# Altium schematic sheet 03 TOPOLOGY.SchDoc: TOPOLOGY
size 420 x 297 mm; SheetNumber: 3; SheetTotal: 4
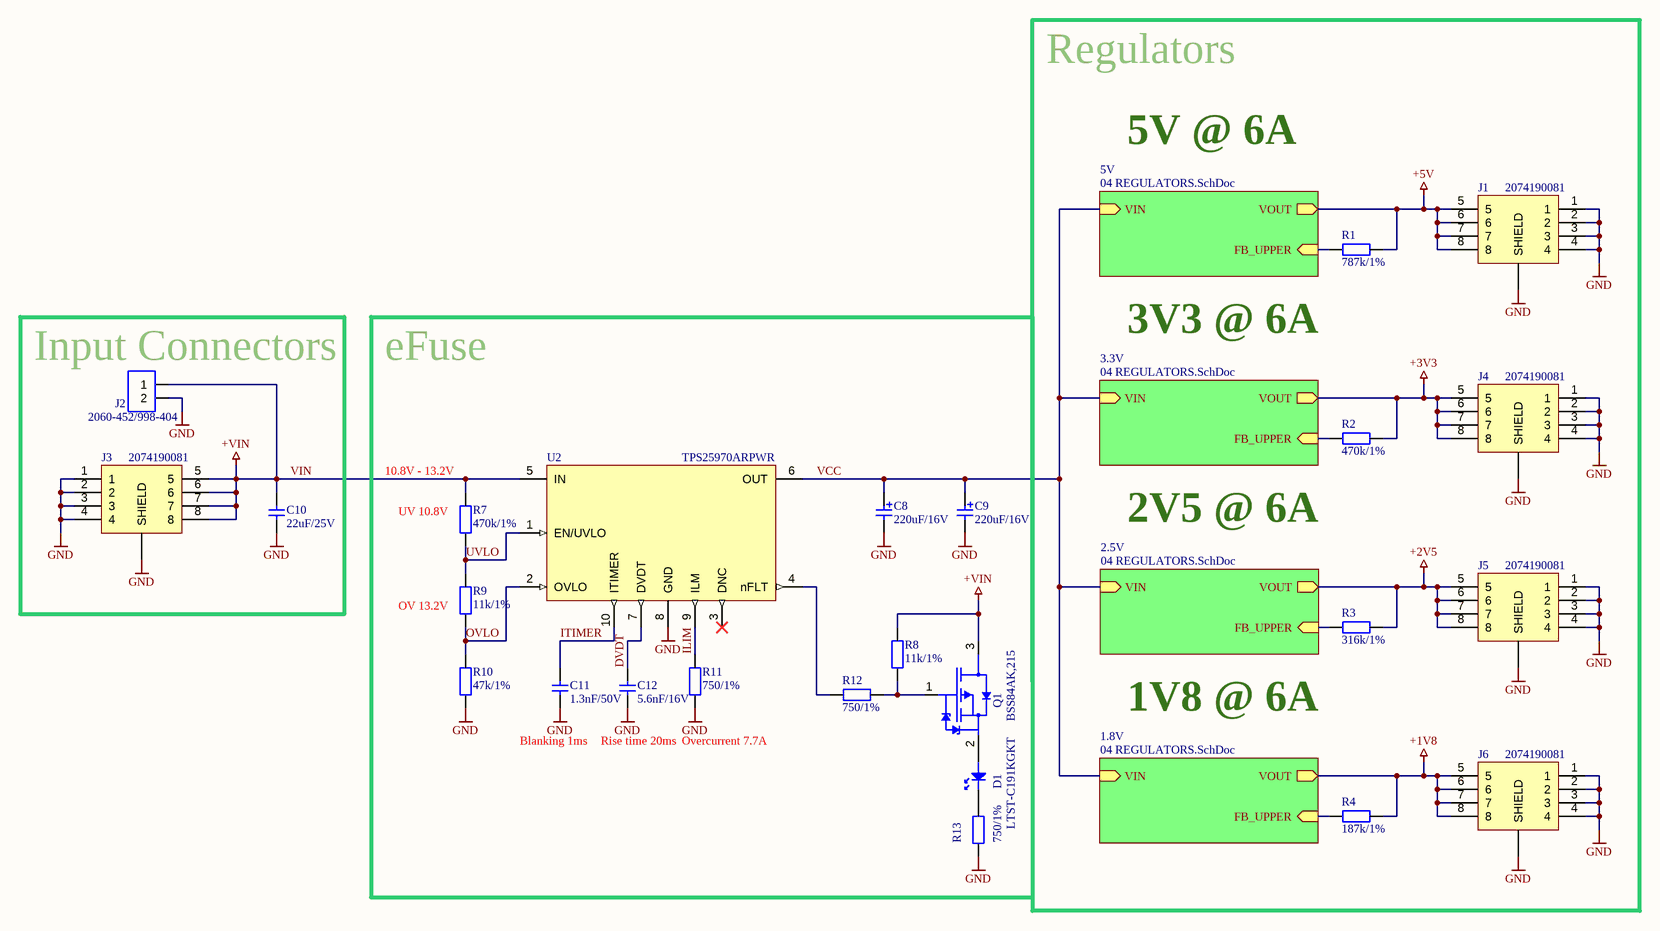
[diagram p0: 03 TOPOLOGY.SchDoc]

## Parts
C8  220uF/16V  [TANTAL/2917]
C9  220uF/16V  [TANTAL/2917]
C10  22uF/25V  [CAPC2012X14M]
C11  1.3nF/50V  [CAPC1005X07M]
C12  5.6nF/16V  [CAPC1005X07M]
D1  LTST-C191KGKT  [LED-0603]
J1  2074190081  [2074190081]
J2  2060-452/998-404  [2060-452/998-404]
J3  2074190081  [2074190081]
J4  2074190081  [2074190081]
J5  2074190081  [2074190081]
J6  2074190081  [2074190081]
Q1  BSS84AK,215  [SOT95P230X110-3M]
R1  787k/1%  [RESC1005X04M]
R2  470k/1%  [RESC1005X04M]
R3  316k/1%  [RESC1005X04M]
R4  187k/1%  [RESC1005X04M]
R7  470k/1%  [RESC1005X04M]
R8  11k/1%  [RESC1005X04M]
R9  11k/1%  [RESC1005X04M]
R10  47k/1%  [RESC1005X04M]
R11  750/1%  [RESC1005X04M]
R12  750/1%  [RESC1005X04M]
R13  750/1%  [RESC1005X04M]
U2  TPS25970ARPWR  [QFN45P200X200X100-16L]

## Blocks framed on the sheet
Input Connectors: C10 J2 J3

## Sub-sheets
1.8V = 04 REGULATORS.SchDoc: VIN (in), VOUT (out), FB_UPPER (in)
2.5V = 04 REGULATORS.SchDoc: VIN (in), VOUT (out), FB_UPPER (in)
3.3V = 04 REGULATORS.SchDoc: VIN (in), VOUT (out), FB_UPPER (in)
5V = 04 REGULATORS.SchDoc: VIN (in), VOUT (out), FB_UPPER (in)

## Nets
+1V8: J6.5 J6.6 J6.7 J6.8 R4.2 ; sheet 1.8V/VOUT
+2V5: J5.5 J5.6 J5.7 J5.8 R3.2 ; sheet 2.5V/VOUT
+3V3: J4.5 J4.6 J4.7 J4.8 R2.2 ; sheet 3.3V/VOUT
+5V: J1.5 J1.6 J1.7 J1.8 R1.2 ; sheet 5V/VOUT
GND: C8.2 C9.2 C10.1 C11.1 C12.1 J1.1 J1.2 J1.3 J1.4 J1.SHLD(SHIELD) J2.2 J3.1 J3.2 J3.3 J3.4 J3.SHLD(SHIELD) J4.1 J4.2 J4.3 J4.4 J4.SHLD(SHIELD) J5.1 J5.2 J5.3 J5.4 J5.SHLD(SHIELD) J6.1 J6.2 J6.3 J6.4 J6.SHLD(SHIELD) R10.1 R11.1 R13.1 U2.8(GND)
VIN: C10.2 J2.1 J3.5 J3.6 J3.7 J3.8 Q1.3(D) R7.2 R8.2 U2.5(IN)  [also labelled +VIN]
DVDT: C12.2 U2.7(DVDT)
ILIM: R11.2 U2.9(ILM)
ITIMER: C11.2 U2.10(ITIMER)
OVLO: R9.1 R10.2 U2.2(OVLO)
UVLO: R7.1 R9.2 U2.1(EN/UVLO)
VCC: C8.1 C9.1 U2.6(OUT) ; sheet 5V/VIN, sheet 3.3V/VIN, sheet 2.5V/VIN, sheet 1.8V/VIN
NetD1_1: D1.1 R13.2
NetD1_2: D1.2 Q1.2(S)
NetQ1_1: Q1.1(G) R8.1 R12.2
NetR1_1: R1.1 ; sheet 5V/FB_UPPER
NetR2_1: R2.1 ; sheet 3.3V/FB_UPPER
NetR3_1: R3.1 ; sheet 2.5V/FB_UPPER
NetR4_1: R4.1 ; sheet 1.8V/FB_UPPER
NetR12_1: R12.1 U2.4(nFLT)

Not connected (* = marked no-connect by the designer): U2 3(DNC)*

## Notes on the sheet
- Regulators
- 5V @ 6A
- 3V3 @ 6A
- eFuse
- (near R7) 10.8V - 13.2V
- (near R7) UV 10.8V
- 2V5 @ 6A
- (near R9) OV 13.2V
- Blanking 1ms
- Rise time 20ms
- (near R11) Overcurrent 7.7A
- 1V8 @ 6A
- Title
- Project
- Size
- Date
- Revision
- A3
- Designed By

## Library data of the parts
C8 C9 = T491D227K016AT: 220 µF Molded Tantalum Capacitors 16 V 2917 (7343 Metric) 500mOhm; ComponentLink1Description: Datasheet; ComponentLink1URL: https://connect.kemet.com:7667/gateway/IntelliData-ComponentDocumentation/1.0/download/datasheet/T491D227K016AT; MPN: T491D227K016AT
C10 = GRT21BR61E226ME13L: 22 µF ±20% 25V Ceramic Capacitor X5R 0805 (2012 Metric); ComponentLink1Description: Datasheet; ComponentLink1URL: https://search.murata.co.jp/Ceramy/image/img/A01X/G101/ENG/GRT21BR61E226ME13-01.pdf; MPN: GRT21BR61E226ME13L
C11 = C0402C132J5GAC7867: 1300 pF ±5% 50V Ceramic Capacitor C0G, NP0 0402 (1005 Metric); ComponentLink1Description: Datasheet; ComponentLink1URL: https://connect.kemet.com:7667/gateway/IntelliData-ComponentDocumentation/1.0/download/datasheet/C0402C132J5GAC7867; MPN: C0402C132J5GAC7867
C12 = CC0402KRX7R7BB562: 5600 pF ±10% 16V Ceramic Capacitor X7R 0402 (1005 Metric); ComponentLink1Description: Datasheet; ComponentLink1URL: https://www.yageo.com/upload/media/product/productsearch/datasheet/mlcc/UPY-GPHC_X7R_6.3V-to-250V_23.pdf; MPN: CC0402KRX7R7BB562
D1 = LTST-C191KGKT: Green 571nm LED Indication - Discrete 2V 0603 (1608 Metric); ComponentLink1Description: Datasheet; ComponentLink1URL: https://optoelectronics.liteon.com/upload/download/DS22-2000-228/LTST-C191KGKT.PDF; MPN: LTST-C191KGKT
J1 J3-J6 = 2074190081: 8 (4 + 4 Power) Position Connector Receptacle, Center Strip Contacts Surface Mount Gold; ComponentLink1Description: Datasheet; ComponentLink1URL: https://www.molex.com/pdm_docs/sd/2074190081_sd.pdf; MPN: 2074190081
J2 = 2060-452/998-404: 2 Position Wire to Board Terminal Block Horizontal with Board 0.157" (4.00mm) Surface Mount; ComponentLink1Description: Datasheet; ComponentLink1URL: https://www.wago.com/global/products/datasheets/Datasheet.pdf?product=2060-452/998-404&lang=en; MPN: 2060-452/998-404
Q1 = BSS84AK,215: P-Channel 50 V 180mA (Ta) 350mW (Ta), 1.14W (Tc) Surface Mount TO-236AB; ComponentLink1Description: Datasheet; ComponentLink1URL: https://assets.nexperia.com/documents/data-sheet/BSS84AK.pdf; MPN: BSS84AK,215
R1 = CRCW0402787KFKED: 787 kOhms ±1% 0.063W, 1/16W Chip Resistor 0402 (1005 Metric) Automotive AEC-Q200 Thick Film; ComponentLink1Description: Datasheet; ComponentLink1URL: https://www.vishay.com/docs/20035/dcrcwe3.pdf; MPN: CRCW0402787KFKED
R2 R7 = CRCW0402787KFKED_1RMCF0402FT470K: 470 kOhms ±1% 0.063W, 1/16W Chip Resistor 0402 (1005 Metric) Automotive AEC-Q200 Thick Film; ComponentLink1Description: Datasheet; ComponentLink1URL: https://www.seielect.com/Catalog/SEI-RMCF_RMCP.pdf; MPN: RMCF0402FT470K
R3 = CRCW0402316KFKED: 316 kOhms ±1% 0.063W, 1/16W Chip Resistor 0402 (1005 Metric) Automotive AEC-Q200 Thick Film; ComponentLink1Description: Datasheet; ComponentLink1URL: https://www.vishay.com/docs/20035/dcrcwe3.pdf; MPN: CRCW0402316KFKED
R4 = CRCW0402187KFKED: 187 kOhms ±1% 0.063W, 1/16W Chip Resistor 0402 (1005 Metric) Automotive AEC-Q200 Thick Film; ComponentLink1Description: Datasheet; ComponentLink1URL: https://www.vishay.com/docs/20035/dcrcwe3.pdf; MPN: CRCW0402187KFKED
R8 R9 = RC0402FR-0711KL: 11 kOhms ±1% 0.063W, 1/16W Chip Resistor 0402 (1005 Metric) Moisture Resistant Thick Film; ComponentLink1Description: Datasheet; ComponentLink1URL: https://www.yageo.com/upload/media/product/productsearch/datasheet/rchip/PYu-RC_Group_51_RoHS_L_12.pdf; MPN: RC0402FR-0711KL
R10 = ERJ-2RKF4702X: 47 kOhms ±1% 0.1W, 1/10W Chip Resistor 0402 (1005 Metric) Automotive AEC-Q200 Thick Film; ComponentLink1Description: Datasheet; ComponentLink1URL: https://industrial.panasonic.com/cdbs/www-data/pdf/RDA0000/AOA0000C304.pdf; MPN: ERJ-2RKF4702X
R11-R13 = RC0402FR-07750RL: 750 Ohms ±1% 0.063W, 1/16W Chip Resistor 0402 (1005 Metric) Moisture Resistant Thick Film; ComponentLink1Description: Datasheet; ComponentLink1URL: https://www.yageo.com/upload/media/product/productsearch/datasheet/rchip/PYu-RC_Group_51_RoHS_L_12.pdf; MPN: RC0402FR-07750RL
U2 = TPS25970ARPWR: 2.7-V TO 23-V, 10-MOHM, 7-A EFUS; ComponentLink1Description: Datasheet; ComponentLink1URL: https://www.ti.com/lit/ds/symlink/tps2597.pdf?ts=1689264287849&ref_url=https%253A%252F%252Fwww.google.com%252F; MPN: TPS25970ARPWR